# EasyEDA schematic 1-Schematic_Nanomixel.json
TITLE: Sheet_1; REV: 1.0; Date: 2023-08-26; Sheet: 1/1; Drawn By: DaukaevRuslan; Company: Your Company
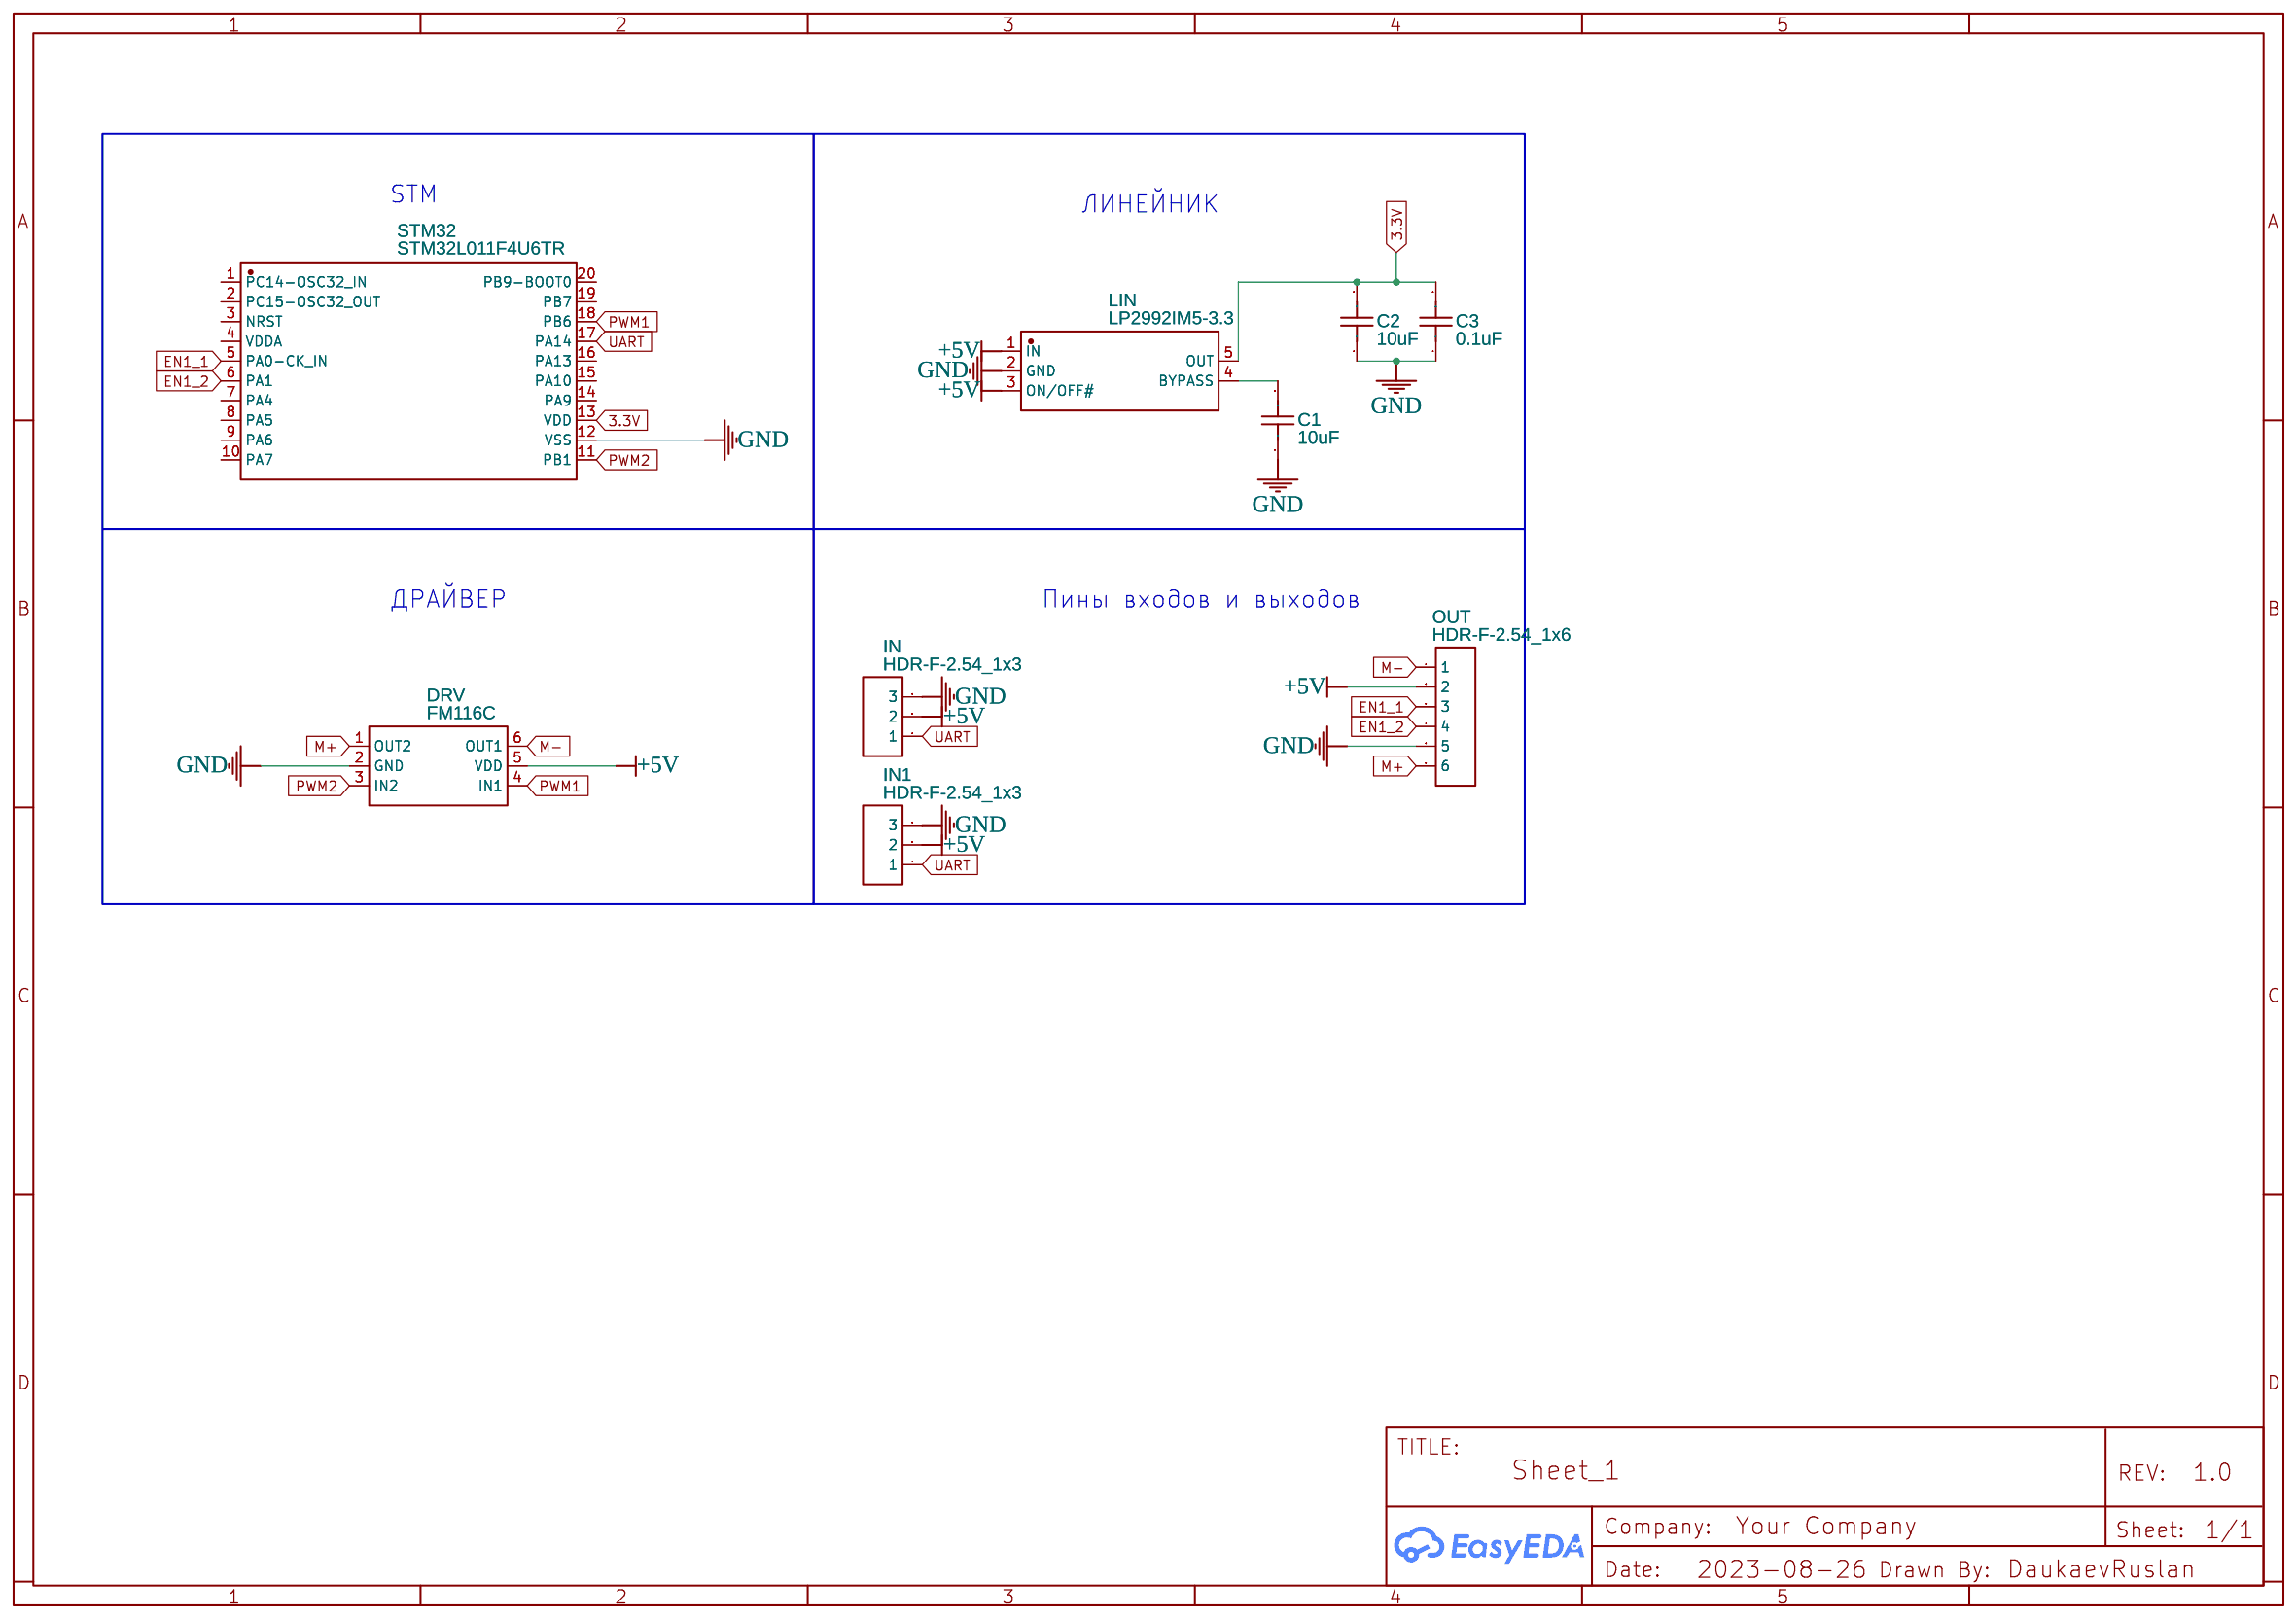
[diagram p0: schematic sheet]

## Parts
C1  10uF  [C0603]
C2  10uF  [C0603]
C3  0.1uF  [C0603]
DRV  FM116C  [SOT-23-6_L2.9-W1.6-P0.95-LS2.9-BL]
IN  HDR-F-2.54_1x3  [HDR-F-2.54_1X3]
IN1  HDR-F-2.54_1x3  [HDR-F-2.54_1X3]
LIN  LP2992IM5-3.3  [SOT-23-5_L2.9-W1.6-P0.95-LS2.8-BL]
OUT  HDR-F-2.54_1x6  [HDR-F-2.54_1X6]
STM32  STM32L011F4U6TR  [QFN-20_L3.0-W3.0-P0.50-BL]

## Library data of the parts
C1-C3 = C_0603_US: Contributor: LCEDA_Lib
DRV = FM116C: Contributor: LCSC; Supplier: LCSC; Supplier Part: C2802264; Manufacturer: FM富满; JLCPCB Part Class: Extended Part; link: https://lcsc.com/eda_search?q=C2802264&%26type=1&ref=editor
IN IN1 = HDR-F-2.54_1x3: Supplier Part: C146690; Supplier: LCSC; Contributor: LCEDA_Lib
LIN = LP2992IM5-3.3: Contributor: lcsc; Supplier: LCSC; Supplier Part: C3751592; Manufacturer: TI(德州仪器); link: https://lcsc.com/eda_search?q=C3751592&%26type=1&ref=editor
OUT = HDR-F-2.54_1x6: Supplier Part: C40877; Supplier: LCSC; Contributor: LCEDA_Lib
STM32 = STM32L011F4U6TR: Contributor: LCSC; Supplier: LCSC; Supplier Part: C329283; Manufacturer: ST(意法半导体); JLCPCB Part Class: Extended Part; link: https://lcsc.com/eda_search?q=C329283&%26type=1&ref=editor

## Nets
3.3V: C2.2 C3.2 LIN.5(OUT) STM32.13(VDD)
+5V: DRV.5(VDD) IN.2 IN1.2 LIN.1(IN) LIN.3(ON/OFF#) OUT.2
GND: C1.1 C2.1 C3.1 DRV.2(GND) IN.3 IN1.3 LIN.2(GND) OUT.5 STM32.12(VSS)
EN1_1: OUT.3 STM32.5(PA0-CK_IN)
EN1_2: OUT.4 STM32.6(PA1)
M+: DRV.1(OUT2) OUT.6
M-: DRV.6(OUT1) OUT.1
PWM1: DRV.4(IN1) STM32.18(PB6)
PWM2: DRV.3(IN2) STM32.11(PB1)
UART: IN.1 IN1.1 STM32.17(PA14)
Net-(C1-2): C1.2 LIN.4(BYPASS)

Not connected (* = marked no-connect by the designer): STM32 1(PC14-OSC32_IN) 2(PC15-OSC32_OUT) 3(NRST) 4(VDDA) 7(PA4) 8(PA5) 9(PA6) 10(PA7) 14(PA9) 15(PA10) 16(PA13) 19(PB7) 20(PB9-BOOT0)

## Notes on the sheet
- STM
- ЛИНЕЙНИК
- ДРАЙВЕР
- Пины входов и выходов
